# Altium schematic sheet Sheet.SchDoc
size A4
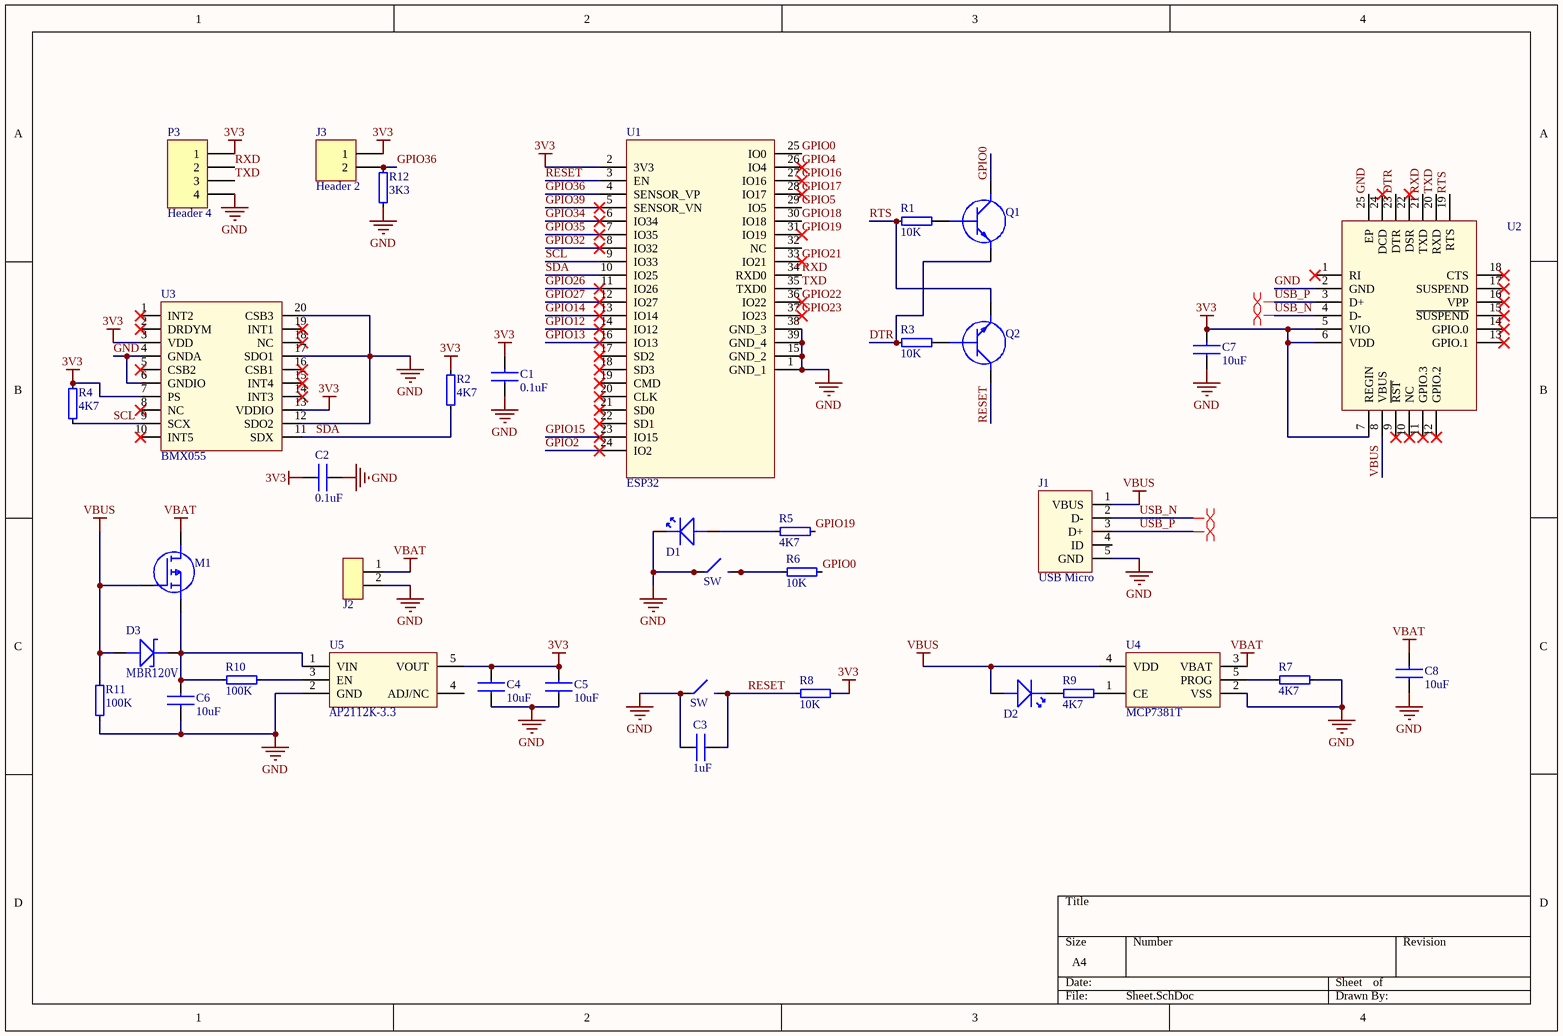
[diagram p0: Sheet.SchDoc]

## Parts
C1  0.1uF  [0402 Capacitor]
C2  0.1uF  [0402 Capacitor]
C3  1uF  [0402 Capacitor]
C4  10uF  [0402 Capacitor]
C5  10uF  [0402 Capacitor]
C6  10uF  [0402 Capacitor]
C7  10uF  [0402 Capacitor]
C8  10uF  [0402 Capacitor]
D1  0805 LED  [0805 LED]  (value not drawn)
D2  0805 LED  [0805 LED]  (value not drawn)
D3  ‎MBR120V  [Shotcky]
J1  USB Micro  [USB Micro]
J2  JSTPH  [JSTPH]  (value not drawn)
J3  Header 2  [HDR1X2]
M1  DMG3415U  [DMG3415U]  (value not drawn)
P3  Header 4  [HDR1X4]
Q1  MMBT2222A  [MMBR2222A]  (value not drawn)
Q2  MMBT2222A  [MMBR2222A]  (value not drawn)
R1  10K  [0402 Resistor]
R2  4K7  [0402 Resistor]
R3  10K  [0402 Resistor]
R4  4K7  [0402 Resistor]
R5  4K7  [0402 Resistor]
R6  10K  [0402 Resistor]
R7  4K7  [0402 Resistor]
R8  10K  [0402 Resistor]
R9  4K7  [0402 Resistor]
R10  100K  [0402 Resistor]
R11  100K  [0402 Resistor]
R12  3K3  [0402 Resistor]
SW1  SW  [Tall Switch]
SW2  SW  [Tall Switch]
U1  ESP32  [ESP32SMD]
U2  CP2104  [CP2104]  (value not drawn)
U3  BMX055  [BMX055]
U4  MCP7381T  [MCP73831T]
U5  ‎AP2112K-3.3  [3V3 Reg]

## Nets
3V3: C1.1 C2.1 C4.2 C5.2 C7.1 J3.1 P3.1 R2.2 R4.2 R8.2 U1.2(3V3) U2.5(VIO) U2.6(VDD) U2.7(REGIN) U3.3(VDD) U3.7(PS) U3.13(VDDIO) U5.5(VOUT)
GND: C1.2 C2.2 C3.2 C4.1 C5.1 C6.1 C7.2 C8.2 D1.1 J1.5(GND) J2.2 P3.4 R7.2 R11.1 R12.1 SW1.1 SW1.2 SW2.1 SW2.2 U1.1(GND_1) U1.15(GND_2) U1.38(GND_3) U1.39(GND_4) U2.2(GND) U2.25(EP) U3.4(GNDA) U3.6(GNDIO) U3.12(SDO2) U3.17(SDO1) U3.20(CSB3) U4.2(VSS) U5.2(GND)
VBAT: C8.1 J2.1 M1.3(D) U4.3(VBAT)
VBUS: D2.2 D3.2 J1.1(VBUS) M1.1(G) R11.2 U2.8(VBUS) U4.4(VDD)
DTR: Q1.2(E) R3.1 U2.23(DTR)
GPIO0: Q1.3(C) R6.2 U1.25(IO0)
GPIO2: U1.24(IO2)
GPIO4: U1.26(IO4)
GPIO5: U1.29(IO5)
GPIO12: U1.14(IO12)
GPIO13: U1.16(IO13)
GPIO14: U1.13(IO14)
GPIO15: U1.23(IO15)
GPIO16: U1.27(IO16)
GPIO17: U1.28(IO17)
GPIO18: U1.30(IO18)
GPIO19: R5.2 U1.31(IO19)
GPIO21: U1.33(IO21)
GPIO22: U1.36(IO22)
GPIO23: U1.37(IO23)
GPIO26: U1.11(IO26)
GPIO27: U1.12(IO27)
GPIO32: U1.8(IO32)
GPIO34: U1.6(IO34)
GPIO35: U1.7(IO35)
GPIO36: J3.2 R12.2 U1.4(SENSOR_VP)
GPIO39: U1.5(SENSOR_VN)
RESET: C3.1 Q2.3(C) R8.1 SW2.3 SW2.4 U1.3(EN)
RTS: Q2.2(E) R1.1 U2.19(RTS)
RXD: P3.2 U1.34(RXD0) U2.21(TXD)
SCL: R4.1 U1.9(IO33) U3.9(SCX)
SDA: R2.1 U1.10(IO25) U3.11(SDX)
TXD: P3.3 U1.35(TXD0) U2.20(RXD)
USB_N: J1.2(D-) U2.4(D-)
USB_P: J1.3(D+) U2.3(D+)
NetC6_2: C6.2 D3.1 M1.2(S) R10.1 U5.1(VIN)
NetD1_2: D1.2 R5.1
NetD2_1: D2.1 R9.1
NetQ1_1: Q1.1(B) R1.2
NetQ2_1: Q2.1(B) R3.2
NetR6_1: R6.1 SW1.3 SW1.4
NetR7_1: R7.1 U4.5(PROG)
NetR9_2: R9.2 U4.1(CE)
NetR10_2: R10.2 U5.3(EN)

Not connected (* = marked no-connect by the designer): J1 4(ID); U1 17(SD2)* 18(SD3)* 19(CMD)* 20(CLK)* 21(SD0)* 22(SD1)* 32(NC); U2 1(RI)* 9(~{RST})* 10(NC)* 11(GPIO.3)* 12(GPIO.2)* 13(GPIO.1)* 14(GPIO.0)* 15(~{SUSPEND})* 16(VPP)* 17(SUSPEND)* 18(CTS)* 22(DSR)* 24(DCD)*; U3 1(INT2)* 2(DRDYM)* 5(CSB2)* 8(NC)* 10(INT5)* 14(INT3)* 15(INT4)* 16(CSB1)* 18(NC)* 19(INT1)*; U5 4(ADJ/NC)

## Layout directives
differential pair; differential pair class USB: USB_N, USB_P

## Library data of the parts
C1-C8 = 0402 Capacitor
  C1 C2: LCSC Part #: C307331
  C3: LCSC Part #: C52923
  C4-C8: LCSC Part #: C15525
D3 = Shotky Diode: LCSC Part #: C130880
J3 = Header 2: Header, 2-Pin; LatestRevisionDate: 17-Jul-2002; LatestRevisionNote: Re-released for DXP Platform.; Publisher: Altium Limited
P3 = Header 4: Header, 4-Pin; LatestRevisionDate: 17-Jul-2002; LatestRevisionNote: Re-released for DXP Platform.; Publisher: Altium Limited
R1-R12 = 0402 Resistor
  R1 R3 R6 R8: LCSC Part #: C25744
  R2 R4 R5 R7 R9: LCSC Part #: C25900
  R10 R11: LCSC Part #: C25741
  R12: LCSC Part #: C25890
SW1 SW2 = Switch
U5 = 3V3 Reg: LCSC Part #: C51118
D1 D2 = 0805 LED: LCSC Part #: C84256
M1 = DMG3415U: LCSC Part #: C96616
Q1 Q2 = MMBT2222A: LCSC Part #: C83939
U2 = CP2104: LCSC Part #: C47742
U3 = BMX055: LCSC Part #: C94022
U4 = MCP7381T: LCSC Part #: C424093